# EAGLE schematic untitled (EAGLE 7.5.0)
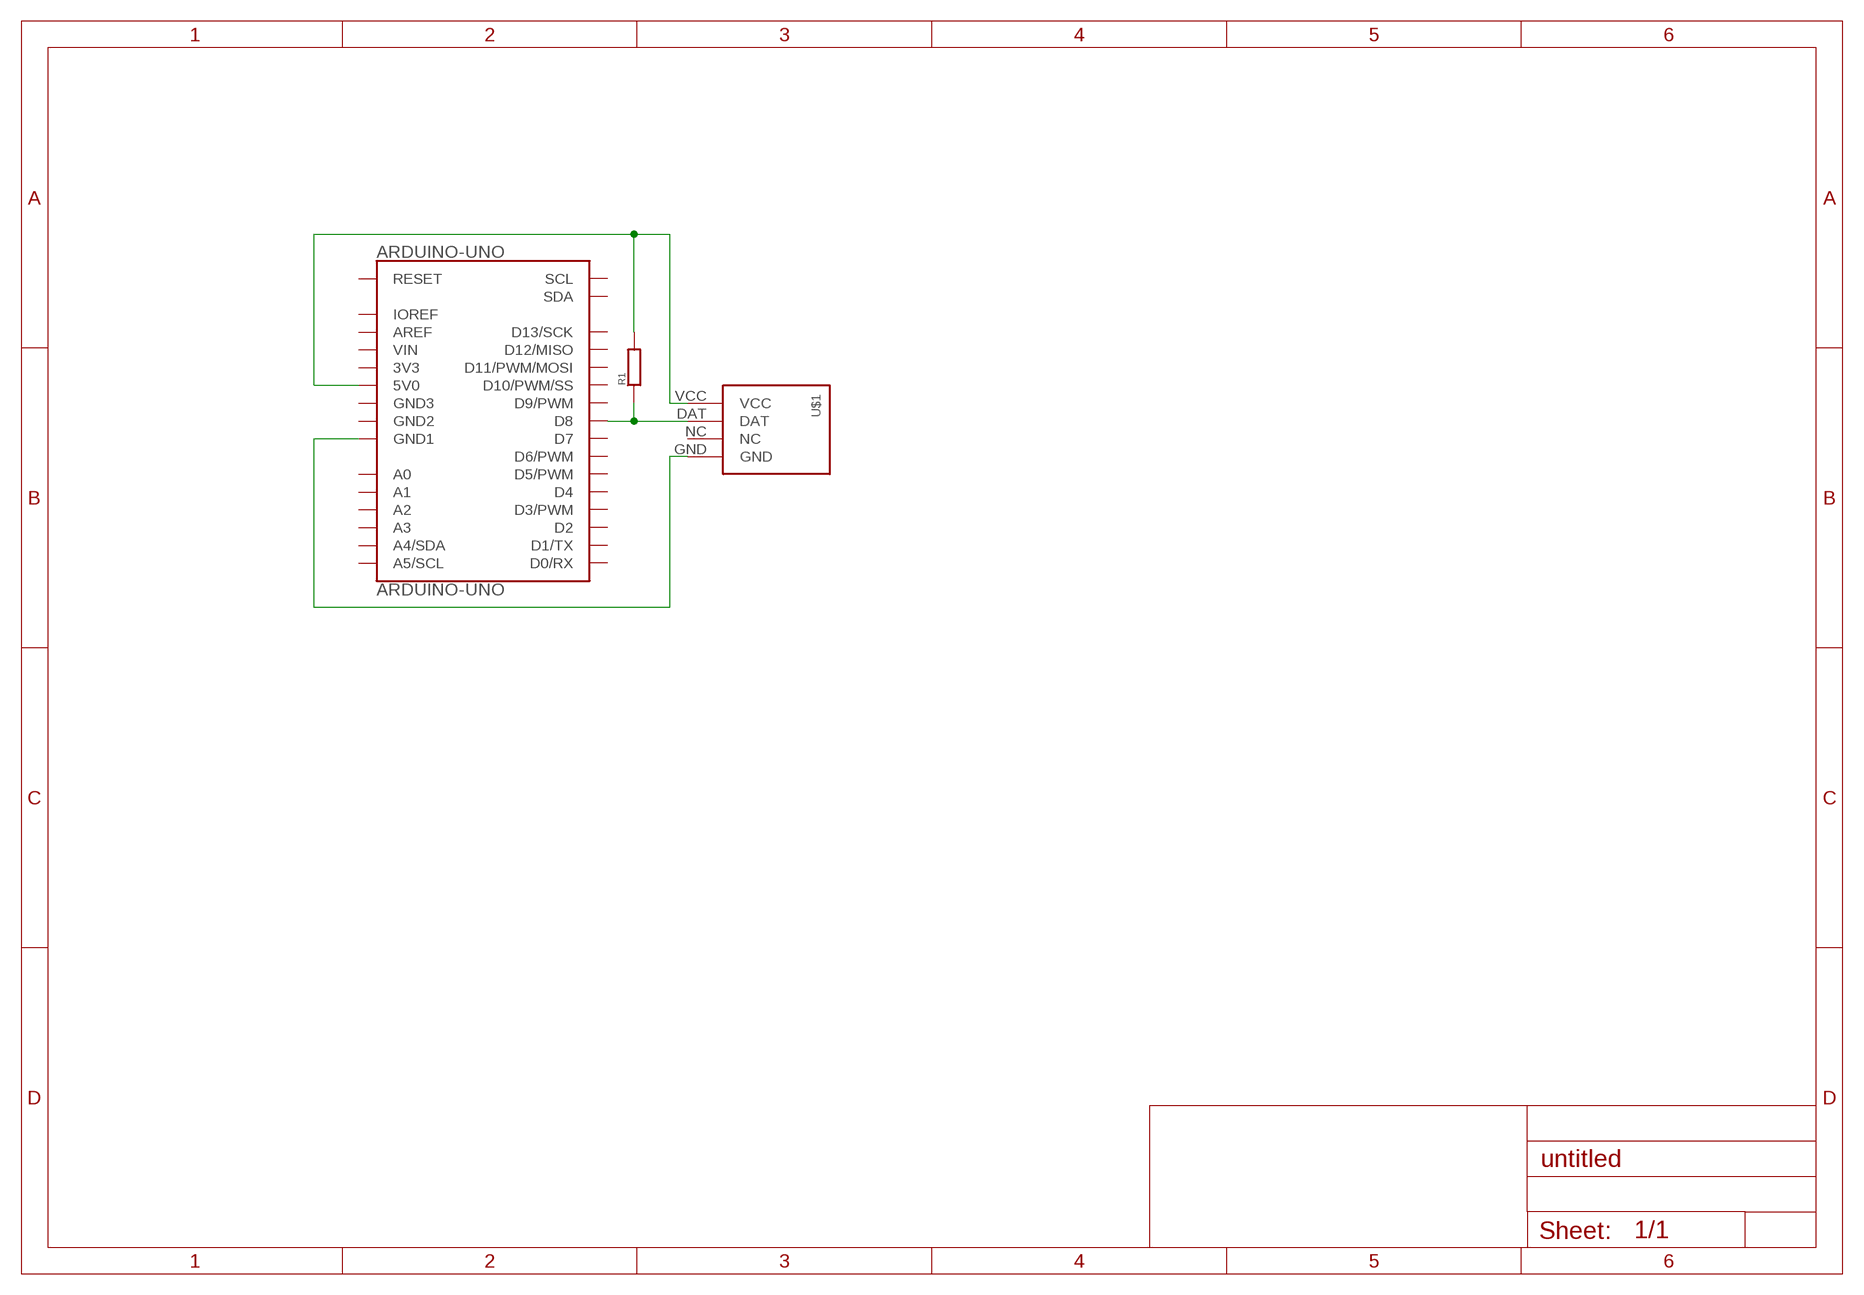
[diagram p0: schematic, sheet 1]

## Parts
ARDUINO-UNO  ARDUINO-UNO  [ARDUINO-UNO]
R1  R0805  [R0805]
U$1  DHT11  [DHT11]

## Nets
5V0: ARDUINO-UNO.5V0 R1.2 U$1.VCC
GND: ARDUINO-UNO.GND1 U$1.GND
N$1: ARDUINO-UNO.D8 R1.1 U$1.DAT
Unconnected: ARDUINO-UNO.3V3 ARDUINO-UNO.A0 ARDUINO-UNO.A1 ARDUINO-UNO.A2 ARDUINO-UNO.A3 ARDUINO-UNO.A4(A4/SDA) ARDUINO-UNO.A5(A5/SCL) ARDUINO-UNO.AREF ARDUINO-UNO.D0(D0/RX) ARDUINO-UNO.D1(D1/TX) ARDUINO-UNO.D2 ARDUINO-UNO.D3(D3/PWM) ARDUINO-UNO.D4 ARDUINO-UNO.D5(D5/PWM) ARDUINO-UNO.D6(D6/PWM) ARDUINO-UNO.D7 ARDUINO-UNO.D9(D9/PWM) ARDUINO-UNO.D10(D10/PWM/SS) ARDUINO-UNO.D11(D11/PWM/MOSI) ARDUINO-UNO.D12(D12/MISO) ARDUINO-UNO.D13(D13/SCK) ARDUINO-UNO.GND2 ARDUINO-UNO.GND3 ARDUINO-UNO.REF(IOREF) ARDUINO-UNO.RST(RESET) ARDUINO-UNO.SCL ARDUINO-UNO.SDA ARDUINO-UNO.VIN U$1.NC

## Library data of the parts
ARDUINO-UNO = Module:ARDUINO-UNO
R1 = RCLDA:R: RESISTOR
U$1 = Senser:DHT11